# EAGLE design avrcp_m (EAGLE 5.10)
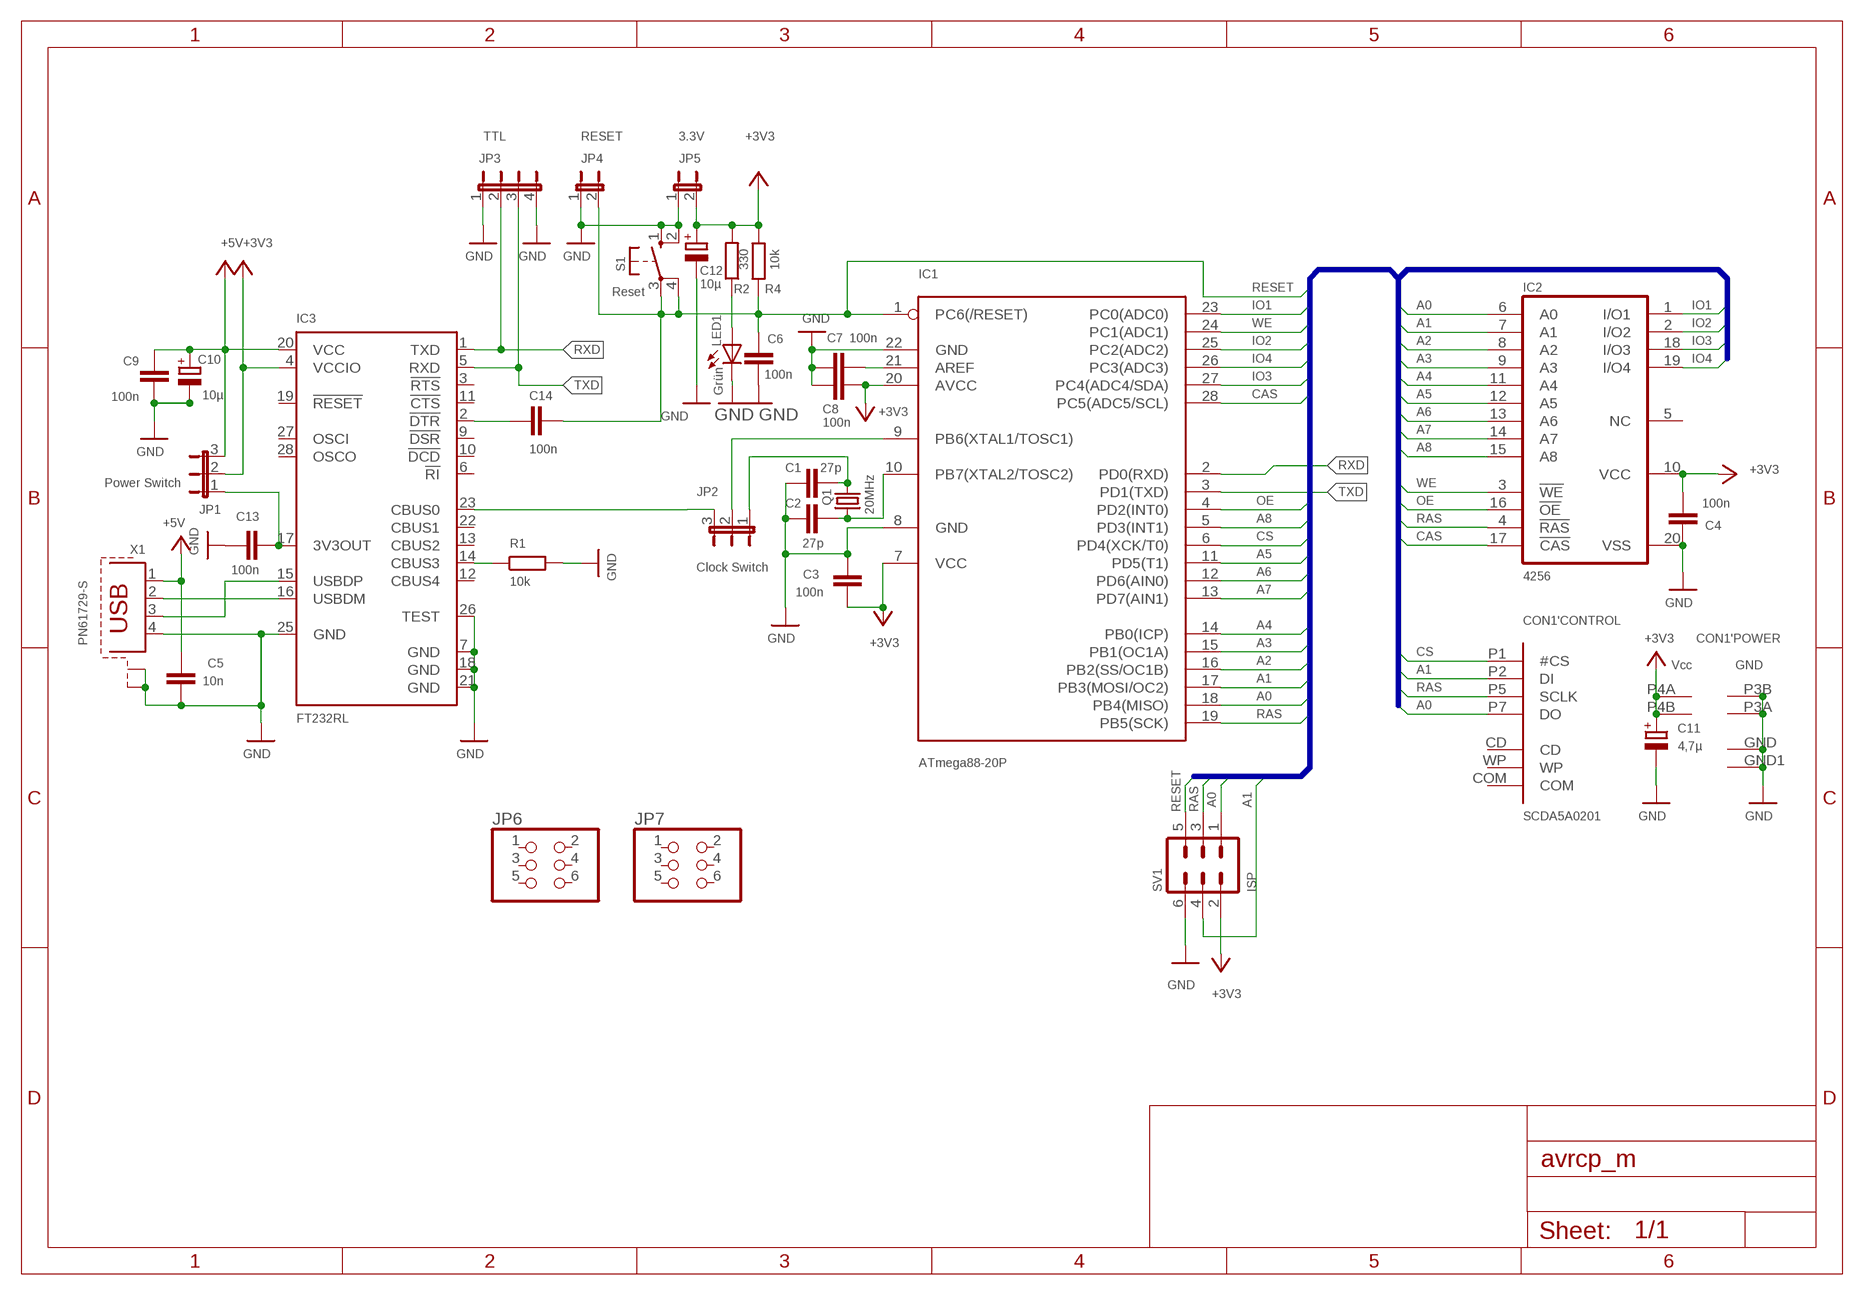
[diagram p0: schematic, sheet 1]

## Parts
C1  27p  C-EU025-024X044  [C025-024X044]
C2  27p  C-EU025-024X044  [C025-024X044]
C3  100n  C-EU025-024X044  [C025-024X044]
C4  100n  C-EU025-024X044  [C025-024X044]
C5  10n  C-EU025-024X044  [C025-024X044]
C6  100n  C-EU025-024X044  [C025-024X044]
C7  100n  C-EU025-024X044  [C025-024X044]
C8  100n  C-EU025-024X044  [C025-024X044]
C9  100n  C-EU025-024X044  [C025-024X044]
C10  10µ  CPOL-EUE2-5  [E2-5]
C11  4,7µ  CPOL-EUE2-4  [E2-4]
C12  10µ  CPOL-EUE2-4  [E2-4]
C13  100n  C-EU025-024X044  [C025-024X044]
C14  100n  C-EU025-024X044  [C025-024X044]
CON1  SCDA5A0201  [SCDA5A0201]
IC1  ATmega88-20P  MEGA8-P  [DIL28-3]
IC2  4256  514256ALP  [DIL20]
IC3  FT232RL  [SSOP28]
JP1  Power Switch  JP2E  [JP2]
JP2  Clock Switch  JP2E  [JP2]
JP3  TTL  JP4E  [JP4]
JP4  RESET  JP1E  [JP1]
JP5  3.3V  JP1E  [JP1]
JP6  PINHD-2X3  [2X03]
JP7  PINHD-2X3  [2X03]
LED1  Grün  LED3MM  [LED3MM]
Q1  20MHz  CRYSTALHC49U-V  [HC49U-V]
R1  10k  R-EU_0207/7  [0207/7]
R2  330  R-EU_0207/7  [0207/7]
R4  10k  R-EU_0207/7  [0207/7]
S1  Reset  10-XX  [B3F-10XX]
SV1  ISP  ML6  [ML6]
X1  PN61729-S  [PN61729-S]

## Nets
+3V3: C3.1 C4.2 C8.1 C11.+ C12.+ CON1.P4A('POWER:VCC) CON1.P4B('POWER:VCC1) IC1.7(VCC) IC1.20(AVCC) IC2.10(VCC) IC3.4(VCCIO) JP1.2 JP5.2 R2.2 R4.1 SV1.2
+5V: C5.2 C9.2 C10.+ IC3.20(VCC) JP1.3 X1.1
A0: CON1.P7('CONTROL:DO) IC1.18(PB4(MISO)) IC2.6(A0) SV1.1
A1: CON1.P2('CONTROL:DI) IC1.17(PB3(MOSI/OC2)) IC2.7(A1) SV1.4
A2: IC1.16(PB2(SS/OC1B)) IC2.8(A2)
A3: IC1.15(PB1(OC1A)) IC2.9(A3)
A4: IC1.14(PB0(ICP)) IC2.11(A4)
A5: IC1.11(PD5(T1)) IC2.12(A5)
A6: IC1.12(PD6(AIN0)) IC2.13(A6)
A7: IC1.13(PD7(AIN1)) IC2.14(A7)
A8: IC1.5(PD3(INT1)) IC2.15(A8)
CAS: IC1.28(PC5(ADC5/SCL)) IC2.17(!CAS)
CS: CON1.P1('CONTROL:#CS) IC1.6(PD4(XCK/T0))
GND: C1.1 C2.1 C3.2 C4.1 C5.1 C6.1 C7.2 C8.2 C9.1 C10.- C11.- C12.- C13.1 CON1.GND1('POWER:GND) CON1.GND('POWER:GND) CON1.P3A('POWER:GND) CON1.P3B('POWER:GND) IC1.8(GND) IC1.22(GND) IC2.20(VSS) IC3.7(GND) IC3.18(GND) IC3.21(GND) IC3.25(GND) IC3.26(TEST) JP3.1 JP3.4 JP4.1 JP5.1 LED1.K(C) R1.2 S1.1(S) S1.2(S1) SV1.6 X1.4 X1.S1 X1.S2
IO1: IC1.23(PC0(ADC0)) IC2.1(I/O1)
IO2: IC1.25(PC2(ADC2)) IC2.2(I/O2)
IO3: IC1.27(PC4(ADC4/SDA)) IC2.18(I/O3)
IO4: IC1.26(PC3(ADC3)) IC2.19(I/O4)
N$1: IC3.14(CBUS3) R1.1
N$2: C13.2 IC3.17(3V3OUT) JP1.1
N$3: C7.1 IC1.21(AREF)
N$4: IC1.9(PB6(XTAL1/TOSC1)) JP2.2
N$5: C2.2 IC1.10(PB7(XTAL2/TOSC2)) Q1.1
N$6: C1.2 JP2.1 Q1.2
N$7: LED1.A R2.1
N$8: IC3.23(CBUS0) JP2.3
N$9: IC3.16(USBDM) X1.2
N$10: IC3.15(USBDP) X1.3
N$11: C14.2 IC3.2(!DTR)
OE: IC1.4(PD2(INT0)) IC2.16(!OE)
RAS: CON1.P5('CONTROL:SCLK) IC1.19(PB5(SCK)) IC2.4(!RAS) SV1.3
RESET: C6.2 C14.1 IC1.1(PC6(/RESET)) JP4.2 R4.2 S1.3(P) S1.4(P1) SV1.5
RXD: IC1.2(PD0(RXD)) IC3.1(TXD) JP3.2
TXD: IC1.3(PD1(TXD)) IC3.5(RXD) JP3.3
WE: IC1.24(PC1(ADC1)) IC2.3(!WE)
Unconnected: CON1.CD('CONTROL:CD) CON1.COM('CONTROL:COM) CON1.WP('CONTROL:WP) IC2.5(NC) IC3.3(!RTS) IC3.6(!RI) IC3.9(!DSR) IC3.10(!DCD) IC3.11(!CTS) IC3.12(CBUS4) IC3.13(CBUS2) IC3.19(!RESET) IC3.22(CBUS1) IC3.27(OSCI) IC3.28(OSCO) JP6.1 JP6.2 JP6.3 JP6.4 JP6.5 JP6.6 JP7.1 JP7.2 JP7.3 JP7.4 JP7.5 JP7.6

## Buses
A[0..8],WE,OE,RAS,CAS,IO[1..4],RESET,CS

## Library data of the parts
C1-C9 C13 C14 = rcl:C-EU: CAPACITOR, European symbol
C10-C12 = rcl:CPOL-EU: POLARIZED CAPACITOR, European symbol
CON1 = SCDA5A0201:SCDA5A0201: ALPS Connector for SDMemory Card SD-CARD SCDA5A0201 SPI -MODE
IC1 = atmel:MEGA8-P: MICROCONTROLLER 8 Kbytes FLASH, 1 kbytes SRAM, 512 bytes EEPROM, USART, 4-channel 10 bit ADC, 2-channel 8 bit ADC Pin compatible with Atmega48, ATMega88, ATMega168 Source: avr.lbr
IC2 = memory-hitachi:514256ALP: MEMORY
IC3 = ftdichip:FT232R: Source: http://www.ftdichip.com/Documents/DataSheets/DS_FT232R_v104.pdf
JP1 JP2 = jumper:JP2E: JUMPER
JP3 = jumper:JP4E: JUMPER
JP4 JP5 = jumper:JP1E: JUMPER
JP6 JP7 = pinhead:PINHD-2X3: PIN HEADER
LED1 = led:LED: LED OSRAM: - CHIPLED LG R971, LG N971, LY N971, LG Q971, LY Q971, LO R971, LY R971 LH N974, LH R974 LS Q976, LO Q976, LY Q976 LO Q996 - Hyper CHIPLED LW Q18S LB Q993, LB Q99A, LB R99A - SideLED LS A670, LO A670, LY A670, LG A670, LP A670 LB A673, LV A673, LT A673, LW A673 LH A674 LY A675 LS A676, LA A676, LO A676, LY A676, LW A676 LS A679, LY A679, LG A679 - Hyper Micro SIDELED® LS Y876, LA Y876, LO Y876, LY Y876 LT Y87S - SmartLED LW L88C, LW L88S LB L89C, LB L89S, LG L890 LS L89K, LO L89K, LY L89K LS L896, LA L896, LO L896, LY L896 - TOPLED LS T670, LO T670, LY T670, LG T670, LP T670 LSG T670, LSP T670, LSY T670, LOP T670, LYG T670 LG T671, LOG T671, LSG T671 LB T673, LV T673, LT T673, LW T673 LH T674 LS T676, LA T676, LO T676, LY T676, LB T676, LH T676, LSB T676, LW T676 LB T67C, LV T67C, LT T67C, LS T67K, LO T67K, LY T67K, LW E67C LS E67B, LA E67B, LO E67B, LY E67B, LB E67C, LV E67C, LT E67C LW T67C LS T679, LY T679, LG T679 LS T770, LO T770, LY T770, LG T770, LP T770 LB T773, LV T773, LT T773, LW T773 LH T774 LS E675, LA E675, LY E675, LS T675 LS T776, LA T776, LO T776, LY T776, LB T776 LHGB T686 LT T68C, LB T68C - Hyper Mini TOPLED® LB M676 - Mini TOPLED Santana® LG M470 LS M47K, LO M47K, LY M47K Source: http://www.osram.convergy.de LUXEON: - LUMILED® LXK2-PW12-R00, LXK2-PW12-S00, LXK2-PW14-U00, LXK2-PW14-V00 LXK2-PM12-R00, LXK2-PM12-S00, LXK2-PM14-U00 LXK2-PE12-Q00, LXK2-PE12-R00, LXK2-PE12-S00, LXK2-PE14-T00, LXK2-PE14-U00 LXK2-PB12-K00, LXK2-PB12-L00, LXK2-PB12-M00, LXK2-PB14-N00, LXK2-PB14-P00, LXK2-PB14-Q00 LXK2-PR12-L00, LXK2-PR12-M00, LXK2-PR14-Q00, LXK2-PR14-R00 LXK2-PD12-Q00, LXK2-PD12-R00, LXK2-PD12-S00 LXK2-PH12-R00, LXK2-PH12-S00 LXK2-PL12-P00, LXK2-PL12-Q00, LXK2-PL12-R00 Source: www.luxeon.com KINGBRIGHT: KA-3528ASYC Source: www.kingbright.com
Q1 = crystal:CRYSTAL: CRYSTAL
R1 R2 R4 = rcl:R-EU_: RESISTOR, European symbol
S1 = switch-omron:10-XX: OMRON SWITCH
SV1 = con-harting-ml:ML6: HARTING
X1 = con-berg:PN61729-S: BERG USB connector

## Board
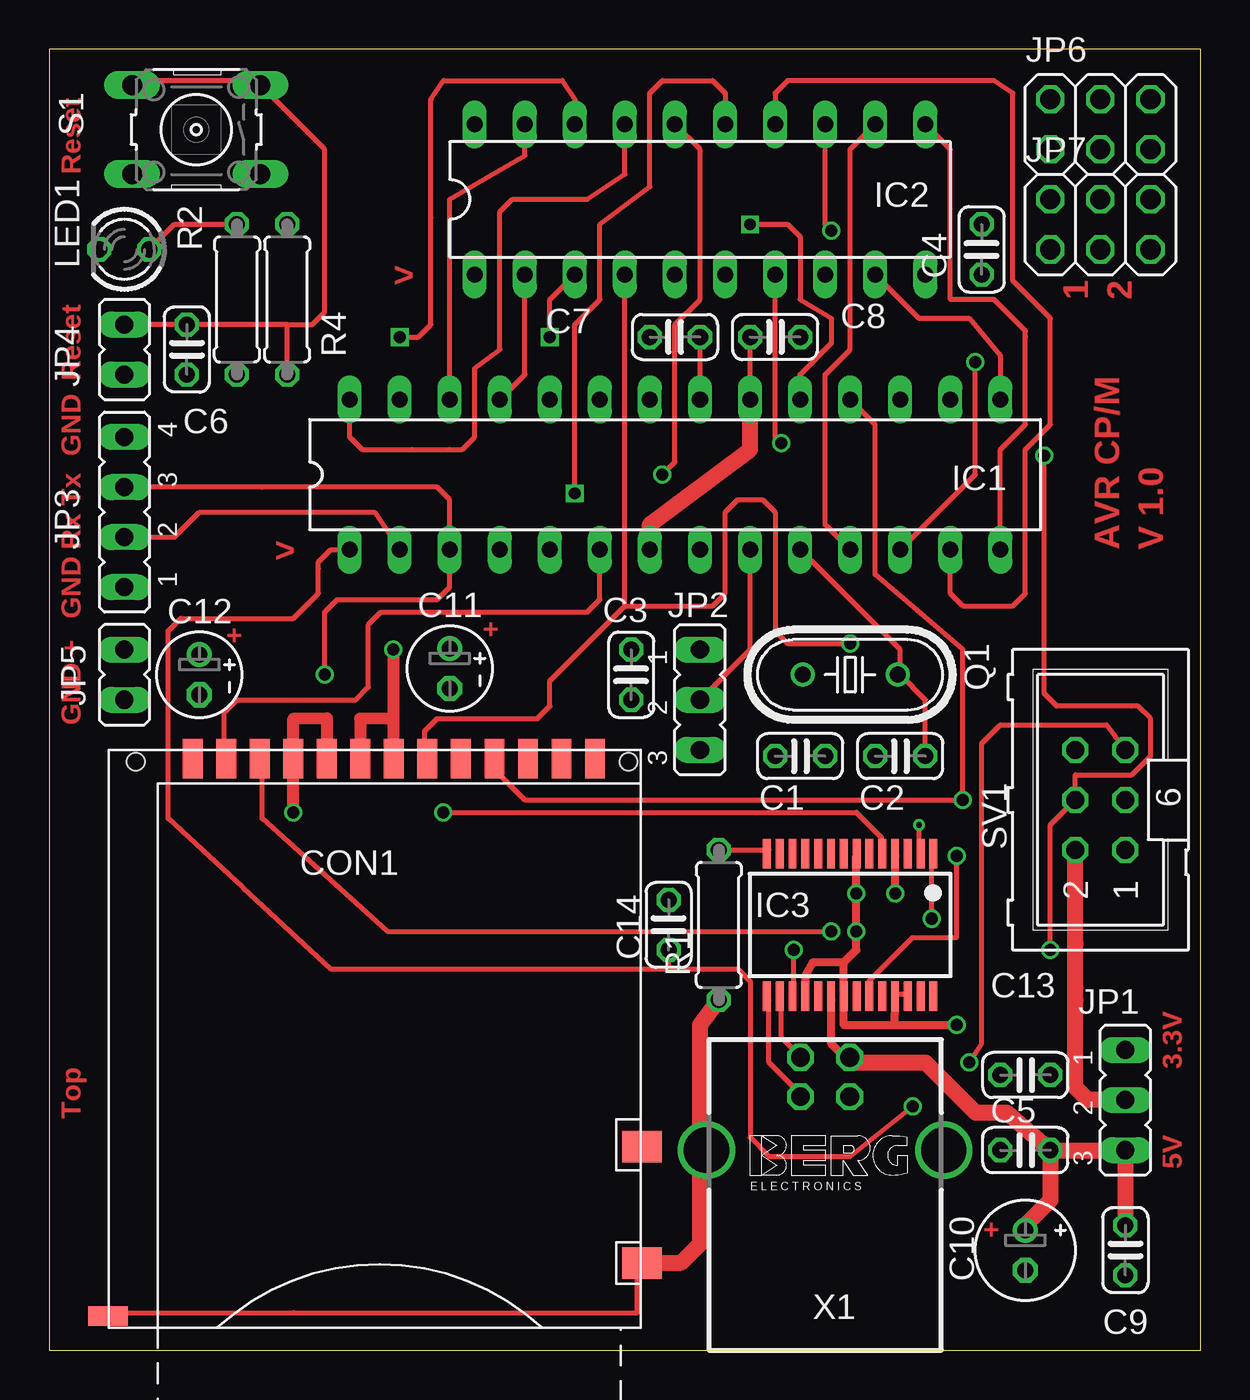
[diagram p1: board, top side]
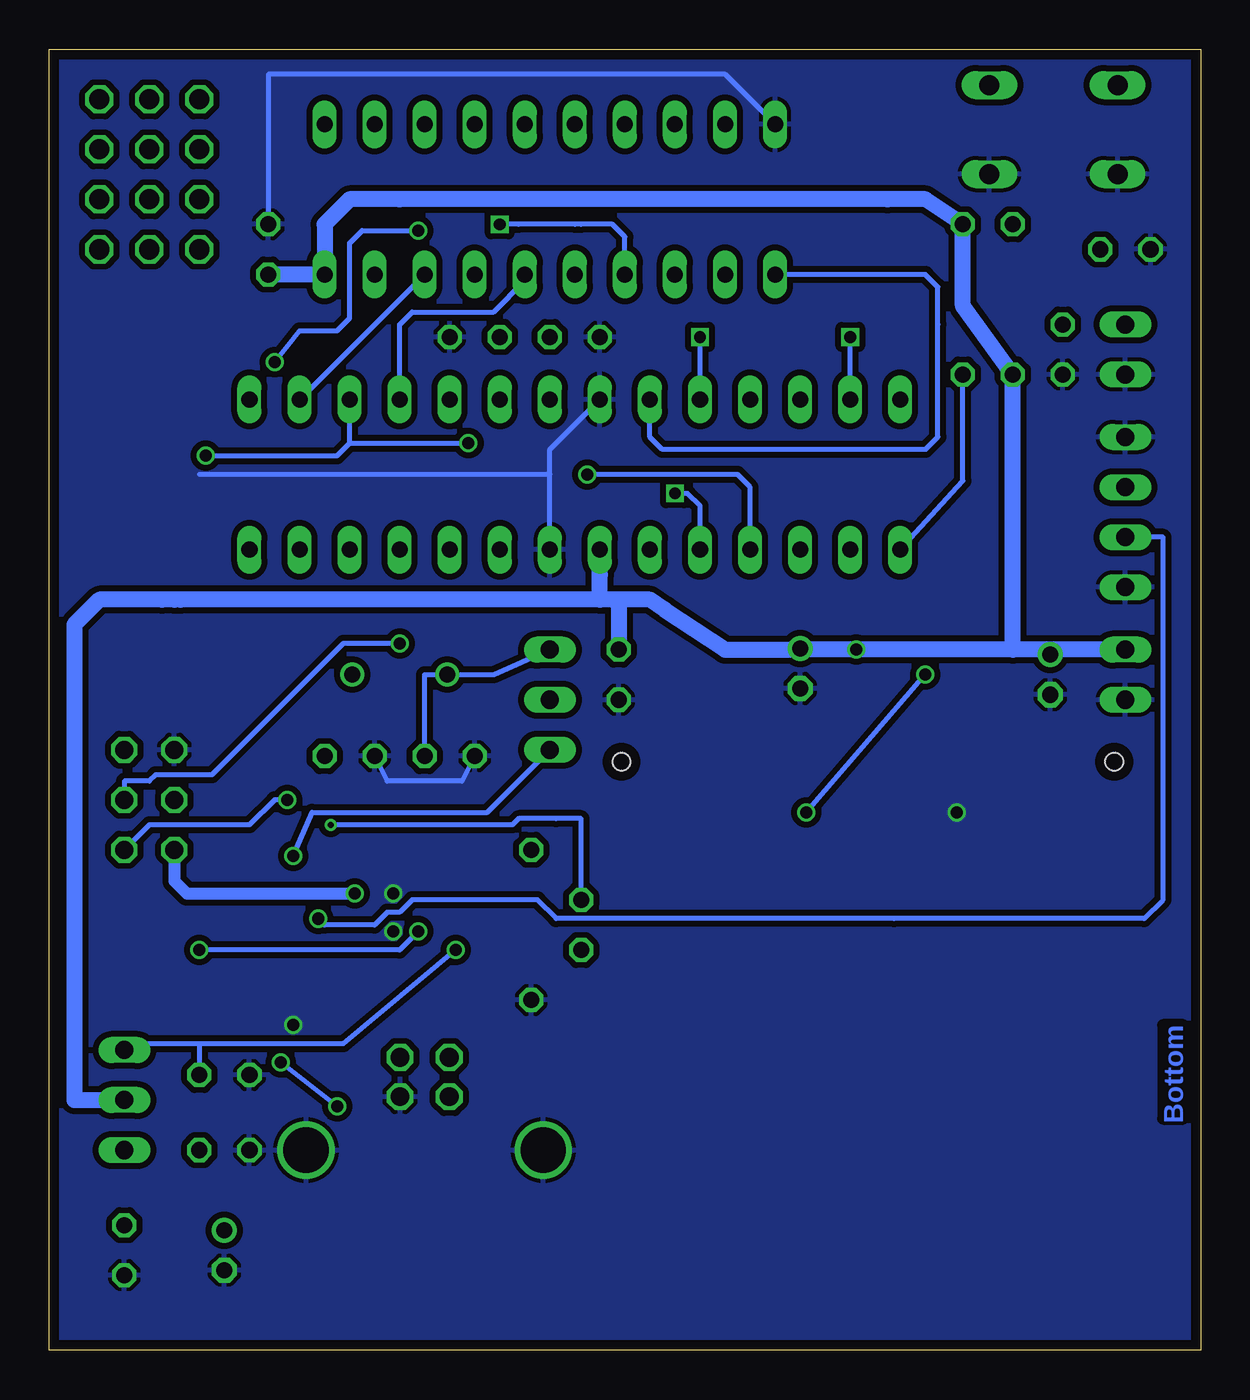
[diagram p2: board, bottom side, seen from below]

Size 58.42 x 66.04 mm. Coordinates in mm from the lower left corner, seen from the top.
Outline: 58.42,66.04 0,66.03 0,0 58.42,0 58.42,66.04
Copper layers (1*16): Top 0.035mm / dielectric 1.5mm / Bottom 0.035mm
Design rules "Eagle-DRU - 1109 - LeitOn - 01 and 02 layers": minimum track width 6mil, minimum drill 0.3mm, track to track 6mil, track to pad 6mil, pad to pad 6mil, via to via 6mil, smd to smd 6mil, copper to edge 20mil, drill to drill 10mil, minimum pad ring 8mil, minimum via ring 6mil, stop-mask expansion 3mil, vias tented up to drill 0mil, thermal gap 8mil

### Footprints (pad centres in the part's own frame; a part is rotated, then mirrored left to right if it is on the bottom)
C025-024X044 = drill 0.813 octagon: 1 -1.27,0; 2 1.27,0
E2-5 = drill 0.813 pad 1.27 round: + -1.016,0 | drill 0.813 pad 1.27 octagon: - 1.016,0
E2-4 = drill 0.813 pad 1.27 round: + -1.016,0 | drill 0.813 pad 1.27 octagon: - 1.016,0
SCDA5A0201 = smd 1 x 2: CD 9.475,-0.45; COM 11.175,-0.45; P1 -7.525,-0.45; P2 -5.825,-0.45; P3A -4.125,-0.45; P3B -2.425,-0.45; P4A -0.725,-0.45; P4B 0.975,-0.45; P5 2.675,-0.45; P6 4.375,-0.45; P7 6.075,-0.45; P8 7.775,-0.45; P9 -9.225,-0.45 | smd 2 x 1.6: GND 13.575,-26.05; WP 13.575,-20.15 | smd 2 x 1: GND1 -13.525,-28.75 | hole 0.9: -12.125,-0.6; 12.875,-0.6
DIL28-3 = drill 0.813 long: 1 -16.51,-3.81; 2 -13.97,-3.81; 3 -11.43,-3.81; 4 -8.89,-3.81; 5 -6.35,-3.81; 6 -3.81,-3.81; 7 -1.27,-3.81; 8 1.27,-3.81; 9 3.81,-3.81; 10 6.35,-3.81; 11 8.89,-3.81; 12 11.43,-3.81; 13 13.97,-3.81; 14 16.51,-3.81; 15 16.51,3.81; 16 13.97,3.81; 17 11.43,3.81; 18 8.89,3.81; 19 6.35,3.81; 20 3.81,3.81; 21 1.27,3.81; 22 -1.27,3.81; 23 -3.81,3.81; 24 -6.35,3.81; 25 -8.89,3.81; 26 -11.43,3.81; 27 -13.97,3.81; 28 -16.51,3.81
DIL20 = drill 0.813 long: 1 -11.43,-3.81; 2 -8.89,-3.81; 3 -6.35,-3.81; 4 -3.81,-3.81; 5 -1.27,-3.81; 6 1.27,-3.81; 7 3.81,-3.81; 8 6.35,-3.81; 9 8.89,-3.81; 10 11.43,-3.81; 11 11.43,3.81; 12 8.89,3.81; 13 6.35,3.81; 14 3.81,3.81; 15 1.27,3.81; 16 -1.27,3.81; 17 -3.81,3.81; 18 -6.35,3.81; 19 -8.89,3.81; 20 -11.43,3.81
SSOP28 = smd 0.4 x 1.5: 1 -4.225,-3.625; 2 -3.575,-3.625; 3 -2.925,-3.625; 4 -2.275,-3.625; 5 -1.625,-3.625; 6 -0.975,-3.625; 7 -0.325,-3.625; 8 0.325,-3.625; 9 0.975,-3.625; 10 1.625,-3.625; 11 2.275,-3.625; 12 2.925,-3.625; 13 3.575,-3.625; 14 4.225,-3.625; 15 4.225,3.625; 16 3.575,3.625; 17 2.925,3.625; 18 2.275,3.625; 19 1.625,3.625; 20 0.975,3.625; 21 0.325,3.625; 22 -0.325,3.625; 23 -0.975,3.625; 24 -1.625,3.625; 25 -2.275,3.625; 26 -2.925,3.625; 27 -3.575,3.625; 28 -4.225,3.625
JP2 = drill 0.914 long: 1 -2.54,0; 2 0,0; 3 2.54,0
JP4 = drill 0.914 long: 1 -3.81,0; 2 -1.27,0; 3 1.27,0; 4 3.81,0
JP1 = drill 0.914 long: 1 0,-1.27; 2 0,1.27
2X03 = drill 1.016 octagon: 1 -2.54,-1.27; 2 -2.54,1.27; 3 0,-1.27; 4 0,1.27; 5 2.54,-1.27; 6 2.54,1.27
LED3MM = drill 0.813 octagon: A -1.27,0; K 1.27,0
HC49U-V = drill 0.813 round: 1 -2.413,0; 2 2.413,0
0207/7 = drill 0.813 octagon: 1 -3.81,0; 2 3.81,0
B3F-10XX = drill 1.016 long: 1 -3.251,2.261; 2 3.251,2.261; 3 -3.251,-2.261; 4 3.251,-2.261
ML6 = drill 0.914 octagon: 1 -2.54,-1.27; 2 -2.54,1.27; 3 0,-1.27; 4 0,1.27; 5 2.54,-1.27; 6 2.54,1.27
PN61729-S = drill 0.95 octagon: 1 1.25,4.71; 2 -1.25,4.71; 3 -1.25,2.71; 4 1.25,2.71 | drill 2.3 pad 2.9 round: S1 -6.02,0; S2 6.02,0

### Placement (x,y rotation side)
C1  38.1,30.16 0 top
C2  43.18,30.16 0 top
C3  29.53,34.29 270 top
C4  47.31,55.88 270 top
C5  49.53,10.16 0 top
C6  6.99,50.8 90 top
C7  31.75,51.44 180 top
C8  36.83,51.44 0 top
C9  54.61,5.08 90 top
C10  49.53,5.08 270 top
C11  20.32,34.61 270 top
C12  7.62,34.29 270 top
C13  49.53,13.97 0 top
C14  31.43,21.59 90 top
CON1  16.51,30.48 0 top
IC1  31.75,44.45 0 top
IC2  33.02,58.42 0 top
IC3  40.64,21.59 180 top
JP1  54.61,12.7 270 top
JP2  33.02,33.02 270 top
JP3  3.81,42.55 90 top
JP4  3.81,50.8 0 top
JP5  3.81,34.29 0 top
JP6  53.34,62.23 0 top
JP7  53.34,57.15 0 top
LED1  3.81,55.88 180 top
Q1  40.64,34.29 180 top
R1  33.97,21.59 270 top
R2  9.53,53.34 270 top
R4  12.06,53.34 270 top
S1  7.46,61.96 180 top
SV1  53.34,27.94 90 top
X1  39.37,10.16 0 top

### Tracks (layer width: path | path; a pad name or v marks a point on that pad's centre or on a via)
+3V3  (via drill 0.61)
  Top 0.254: 17.46,30.48 CON1.P4B 17.46,32.07 | 42.93,25.08 IC3.4 | 35.24,48.58 IC1.20 35.56,48.58 C8.1
  Top 0.406: v42.93,23.18 42.93,25.08
  Top 0.61: v17.46,35.56 17.46,32.07 | 17.46,32.07 17.46,30.48 | 17.46,32.07 15.77,32.05 CON1.P4A
  Top 0.813: JP1.2 52.7,12.7 52.07,13.34 52.07,17.14 52.07,17.78 52.07,18.41 52.07,20.64 SV1.2 | IC1.7 30.48,41.91 35.56,45.72 IC1.20
  Bottom 0.254: C12.+ 9.53,35.56 7.62,35.56 | 20.32,35.56 C11.+ | 27.21,37.61 27.3,37.47 | 52.39,38.1 52.07,38.1 51.75,38.1 | 29.53,38.1 29.53,37.78 | 52.7,38.1 55.88,38.1 52.7,38.1
  Bottom 0.305: 52.7,38.1 55.88,38.1 | 27.94,38.1 24.13,35.56 9.53,35.56
  Bottom 0.61: v42.93,23.18 50.48,23.18 51.44,23.18 52.07,23.81 SV1.2
  Bottom 0.813: JP5.2 7.62,35.56 9.53,35.56 | 9.53,35.56 v17.46,35.56 20.32,35.56 24.13,35.56 27.21,37.61 27.94,38.1 | 27.94,38.1 29.53,38.1 | 29.53,38.1 30.48,38.1 30.48,39.37 IC1.7 | 27.94,38.1 29.53,38.1 | 29.53,38.1 51.75,38.1 | 51.75,38.1 52.07,38.1 | JP1.2 57.15,12.7 57.15,36.83 55.88,38.1 52.7,38.1 52.07,38.1 | C4.2 IC2.10 44.45,57.15 43.18,58.42 40.64,58.42 15.88,58.42 13.97,58.42 R4.1 12.06,53.02 R2.2 9.53,35.56 | 29.53,37.78 C3.1 | 51.75,38.1 52.07,38.1
+5V
  Top 0.254: 49.53,6.35 C10.+ | 39.69,17.78 IC3.20 | X1.1 40.32,14.92
  Top 0.406: 39.69,17.78 39.69,15.56 40.32,14.92
  Top 0.813: C9.2 JP1.3 C5.2 | 49.53,6.35 50.8,7.62 C5.2 | C5.2 48.58,12.06 47.62,12.06 46.99,12.06 45.72,13.34 44.45,14.61 40.88,14.61 X1.1
A0  (via drill 0.61)
  Top 0.254: IC1.18 41.91,46.99 41.91,39.37 46.35,35.56 46.35,34.61 v46.35,27.94 24.13,27.94 22.86,29.21 CON1.P7
  Bottom 0.254: IC2.6 34.29,54.29 35.88,52.7 40.01,52.7 40.64,52.07 IC1.18 | SV1.1 53.34,26.67 48.26,26.67 46.99,27.94 v46.35,27.94
A1  (via drill 0.61)
  Top 0.254: v37.15,46.04 36.83,46.35 IC2.7 | v39.69,21.27 17.14,21.27 10.79,26.99 10.79,29.21 10.79,29.84 CON1.P2 | v50.8,20.32 50.8,26.67 SV1.4 52.07,29.21 54.93,29.21 55.88,30.16 55.88,32.07 55.24,32.7 54.93,32.7 51.12,32.7 50.48,33.34 v50.48,45.4
  Bottom 0.254: 43.18,46.04 IC1.17 | 43.18,46.04 v37.15,46.04 | v39.69,21.27 40.64,20.32 v50.8,20.32 | 43.18,46.04 43.81,45.4 v50.48,45.4
A2
  Bottom 0.254: IC2.8 41.91,52.07 IC1.16
A3
  Top 0.254: IC2.9 44.13,52.39 46.67,52.39 48.26,50.48 IC1.15
A4
  Top 0.254: IC1.14 48.26,45.72 49.53,46.99 49.53,51.44 49.53,51.75 47.94,53.34 45.72,53.34 45.72,60.96 IC2.11
A5
  Top 0.254: IC1.11 39.37,41.91 39.37,49.53 40.64,50.8 40.64,60.96 IC2.12
A6  (via drill 0.61)
  Top 0.254: IC1.12 46.99,44.45 v46.99,50.16 | v39.69,56.83 39.37,57.15 IC2.13
  Bottom 0.254: v46.99,50.16 45.72,51.75 45.09,51.75 44.13,51.75 43.81,51.75 43.18,52.39 43.18,56.2 42.55,56.83 v39.69,56.83
A7
  Top 0.254: IC1.13 45.72,38.42 46.35,37.78 48.9,37.78 49.53,38.42 49.53,45.72 50.8,46.99 50.8,52.39 48.9,54.29 48.9,63.82 47.94,64.45 37.47,64.45 36.83,63.82 IC2.14
A8  (via drill 0.6)
  Top 0.254: v26.67,43.5 26.67,52.07 27.94,53.34 27.94,57.15 30.48,59.05 30.48,63.82 31.11,64.45 33.66,64.45 34.29,63.82 IC2.15
  Bottom 0.254: IC1.5 25.4,42.86 26.04,43.5 v26.67,43.5
CAS
  Top 0.254: IC2.17 29.21,59.69 27.3,58.42 23.5,58.42 22.86,57.78 22.86,50.8 21.59,49.85 21.59,46.35 20.95,45.72 20.32,45.72 18.41,45.72 15.88,45.72 15.24,46.35 IC1.28
CS
  Top 0.254: IC1.6 27.94,38.1 27.3,37.47 16.83,37.47 16.19,36.83 16.19,33.66 15.56,33.02 9.53,33.02 8.89,32.38 8.89,30.16 CON1.P1
GND  (via drill 0.61)
  Top 0.254: IC3.26 43.5,18.1 42.86,18.1 IC3.25 42.86,17.78 42.91,17.14 | 38.37,18.09 IC3.18 | 40.32,18.1 IC3.21 40.32,17.78 | 40.96,25.08 IC3.7 | CON1.GND1 3.17,1.91 12.38,1.91 29.84,1.91 29.84,4.13 CON1.GND | C10.- 49.53,3.81 C10.- | 33.02,16.51 X1.S1 33.02,16.51
  Top 0.406: 38.37,18.09 38.37,19.04 38.73,19.68 40.32,19.68 | 40.32,18.1 40.32,19.68 | 40.96,25.08 v40.96,23.18 v40.96,21.27 40.96,20.32 40.32,19.68 | 42.91,16.51 42.91,17.14 | 42.91,16.51 40.32,16.51 40.32,17.78 | 42.91,16.51 v46.04,16.51 42.91,16.51
  Top 0.61: v12.38,27.3 CON1.P3A 12.38,32.07 14.09,32.08 CON1.P3B
  Top 0.813: R1.2 33.02,16.51 33.02,6.99 33.02,5.71 33.02,5.4 32.07,4.45 CON1.GND
  Bottom 0.254: C1.1 37.47,28.89 41.27,28.89 C2.1 | 33.02,44.45 33.02,45.72 IC1.22 | IC1.8 33.02,44.45 | 33.02,44.45 50.8,44.45 | X1.4 40.64,12.7 | C4.1 47.31,64.77 24.13,64.77 IC2.20
  pour Bottom (isolate 0.305): 0,66.04 58.42,66.04 58.42,0 0,0
IO1
  Bottom 0.254: IC2.1 13.97,54.61 13.34,53.98 13.34,52.07 13.34,46.35 13.97,45.72 27.3,45.72 27.94,46.35 IC1.23
IO2
  Top 0.254: IC1.25 24.13,49.53 IC2.2
IO3  (via drill 0.6)
  Top 0.254: IC2.18 26.67,63.5 26.04,64.45 20,64.45 19.37,63.5 19.37,57.47 19.37,52.07 18.73,51.44 v17.78,51.44
  Bottom 0.254: 17.78,48.58 v17.78,51.44
  Bottom 0.406: IC1.27 17.78,48.58
IO4
  Top 0.254: IC1.26 20.32,49.53 20.32,58.42 24.13,60.64 IC2.19
N$1
  Top 0.254: R1.1 36.51,25.4 IC3.14
N$2  (via drill 0.61)
  Top 0.254: v37.78,20.32 37.78,18.1 IC3.17
  Bottom 0.254: 50.8,15.56 C13.2 | 50.8,15.56 53.98,15.56 JP1.1 | v37.78,20.32 43.5,15.56 50.8,15.56
N$3
  Top 0.254: IC1.21 C7.1
N$4
  Top 0.254: IC1.9 35.56,35.56 JP2.2
N$5
  Top 0.254: C2.2 44.45,33.02 43.18,34.29 | 43.18,34.29 Q1.1 43.18,34.29 | IC1.10 43.18,35.56 43.18,34.29
N$6
  Bottom 0.254: C1.2 39.37,34.29 Q1.2 | Q1.2 38.1,34.29 | Q1.2 38.1,34.29 | JP2.1 35.88,34.29 38.1,34.29 | Q1.2 38.1,34.29
N$7
  Top 0.254: LED1.A 6.35,57.15 R2.1
N$8  (via drill 0.61)
  Top 0.254: v46.04,25.08 46.04,20.95 43.81,20.95 41.59,18.73 41.59,18.1 IC3.23
  Bottom 0.254: v46.04,25.08 45.09,27.3 36.2,27.3 JP2.3
N$9
  Top 0.254: IC3.16 37.15,17.78 37.15,15.88 38.1,14.92 X1.2
N$10
  Top 0.254: IC3.15 36.51,17.78 36.51,14.61 38.1,13.02 X1.3
N$11  (via drill 0.3)
  Top 0.152: 44.13,26.04 44.13,25.4 IC3.2
  Top 0.254: v44.13,26.67 44.13,26.04
  Bottom 0.254: v44.13,26.67 42.23,26.67 34.92,26.67 34.61,26.99 32.7,26.99 31.43,26.99 C14.2
OE  (via drill 0.61)
  Top 0.254: v31.11,44.45 31.75,45.09 31.75,52.07 33.02,53.34 33.02,60.96 IC2.16
  Bottom 0.254: IC1.4 22.86,43.81 23.5,44.45 v31.11,44.45
RAS  (via drill 0.6, 0.61)
  Top 0.254: 29.21,37.78 IC2.4 | CON1.P5 19.05,30.48 19.05,31.43 19.68,32.07 23.81,32.07 24.77,32.07 25.4,32.7 25.4,33.97 26.67,35.24 29.21,37.78 | 29.21,37.78 33.66,37.78 34.29,38.42 34.29,42.55 34.92,43.18 36.2,43.18 36.83,42.55 36.83,36.51 37.47,35.88 v40.64,35.88 | IC1.19 38.1,49.53 39.69,51.12 39.69,52.39 38.1,53.34 38.1,56.52 37.47,57.15 v35.56,57.15
  Bottom 0.254: SV1.3 54.61,28.89 53.34,28.89 53.02,29.21 50.16,29.21 43.5,35.88 v40.64,35.88 | IC2.4 29.21,56.52 29.84,57.15 31.43,57.15 31.75,57.15 34.61,57.15 | 34.61,57.15 v35.56,57.15 34.61,57.15
RESET  (via drill 0.61)
  Top 0.152: 9.84,23.5 9.83,23.48
  Top 0.254: S1.4 4.45,64.45 10.48,64.45 S1.3 10.79,64.14 13.97,60.96 13.97,52.7 13.34,52.07 12.06,52.07 | JP4.2 C6.2 8.57,52.07 12.06,52.07 | R4.2 12.06,52.07 | 31.43,19.37 14.29,19.37 9.83,23.48 6.03,26.99 6.03,35.88 6.03,36.51 6.67,37.15 12.38,37.15 13.65,38.42 13.65,39.69 13.65,40.01 14.29,40.64 IC1.1 | 31.43,19.37 34.92,19.37 35.56,18.73 35.56,10.79 36.51,9.84 40.64,9.84 v43.81,12.38 | v46.67,14.61 47.31,15.56 47.31,30.8 48.26,31.75 53.66,31.75 SV1.5 | 31.43,19.37 C14.1
  Bottom 0.254: IC1.1 12.06,44.13 R4.2 | v43.81,12.38 v46.67,14.61
RXD  (via drill 0.61)
  Top 0.254: v44.77,21.91 44.77,25.08 IC3.1 | IC1.2 16.51,42.55 7.62,42.55 6.35,41.27 JP3.2
  Bottom 0.254: 1.91,37.47 1.91,38.1 | 1.91,37.47 1.91,38.1 | 1.91,38.1 1.91,41.27 JP3.2 | 1.91,37.47 1.91,32.7 1.91,22.86 2.86,21.91 15.56,21.91 32.7,21.91 33.66,22.86 40.01,22.86 40.64,22.23 41.27,22.23 41.91,21.59 44.45,21.59 v44.77,21.91 | 1.91,37.47 1.91,38.1
TXD  (via drill 0.61)
  Top 0.254: IC3.5 42.23,25.4 42.23,26.04 40.96,27.3 v20,27.3 | v13.97,34.29 13.97,37.47 14.61,38.1 19.68,38.1 20.32,38.73 | 20.32,38.73 IC1.3 | 20.32,38.73 20.32,43.18 19.68,43.81 10.79,43.81 JP3.3
  Bottom 0.254: v20,27.3 v13.97,34.29
WE  (via drill 0.6)
  Top 0.254: v25.4,51.44 25.4,53.34 IC2.3
  Bottom 0.254: IC1.24 v25.4,51.44

### Text on the board
Top: Reset | > | 1 | 2 | Reset | GND | Tx | Rx | AVR CP/M | V 1.0 | > | GND | + | + | + | GND | 3.3V | Top | 5V | +
Bottom: Bottom